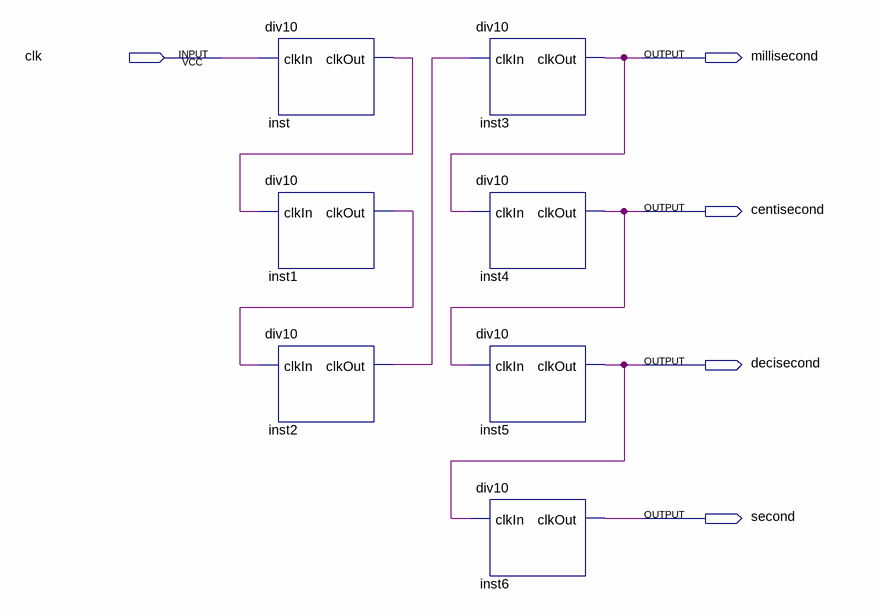
[diagram p0: schematic sheet]
// Quartus schematic clkDiv.bdf as structural Verilog: 7 symbols, 5 pins
module clkDiv (
  input  clk,
  output millisecond,
  output centisecond,
  output decisecond,
  output second
);

  wire inst1_clkout, inst2_clkout, inst_clkout;

  div10 inst (.clkIn(clk), .clkOut(inst_clkout));
  div10 inst1 (.clkIn(inst_clkout), .clkOut(inst1_clkout));
  div10 inst2 (.clkIn(inst1_clkout), .clkOut(inst2_clkout));
  div10 inst3 (.clkIn(inst2_clkout), .clkOut(millisecond));
  div10 inst4 (.clkIn(millisecond), .clkOut(centisecond));
  div10 inst5 (.clkIn(centisecond), .clkOut(decisecond));
  div10 inst6 (.clkIn(decisecond), .clkOut(second));
endmodule
